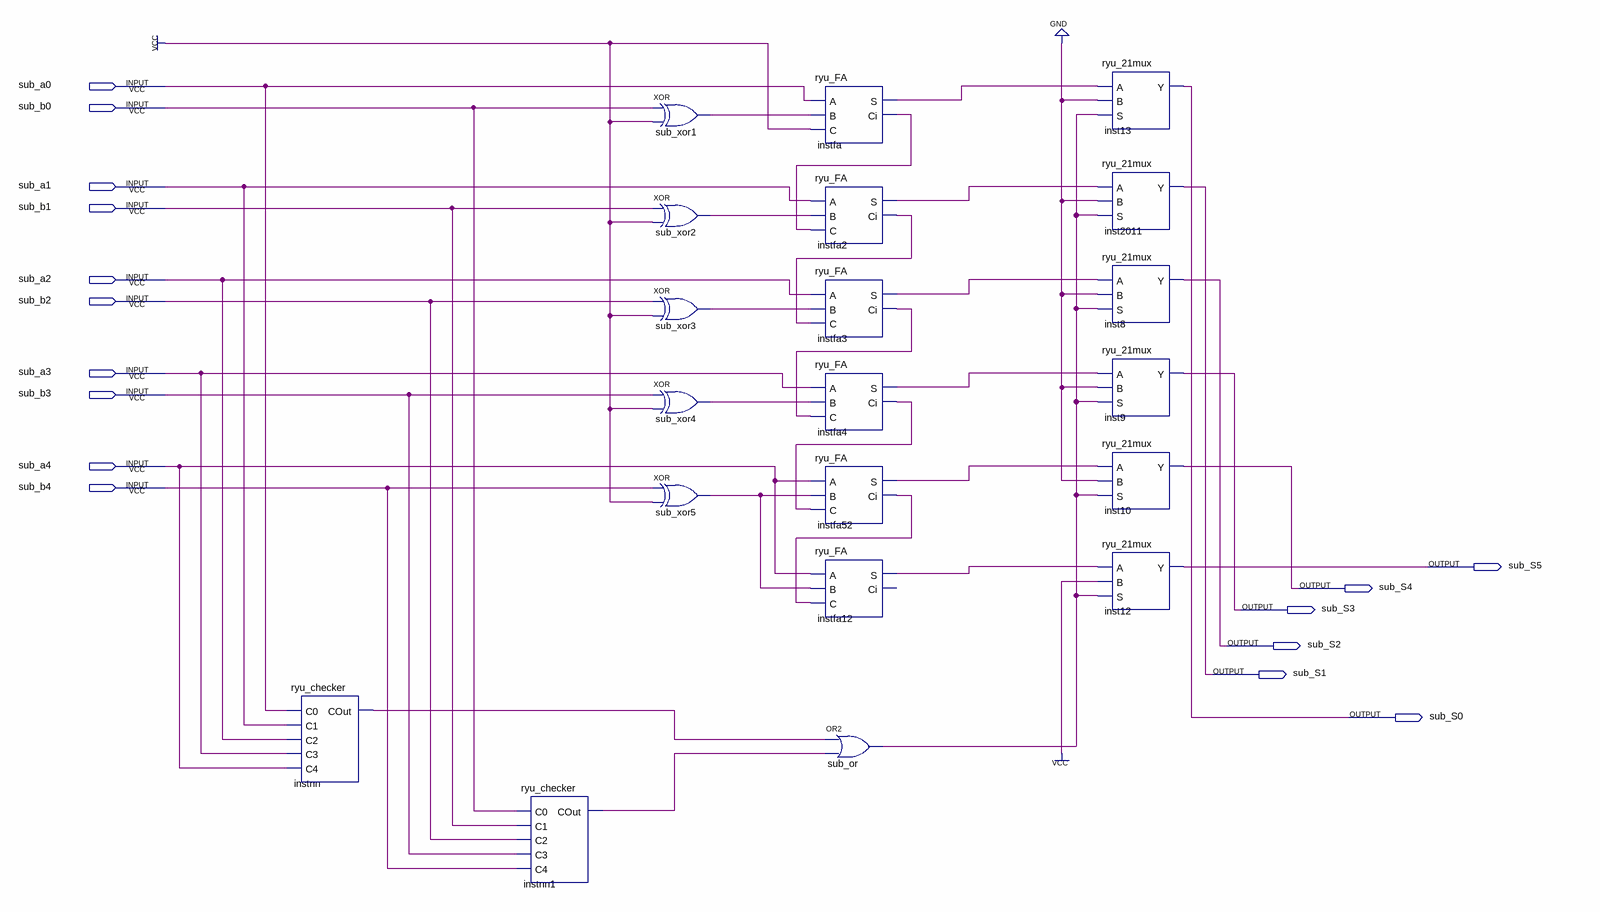
[diagram p0: schematic sheet]
// Quartus schematic ryu_subtractor.bdf as structural Verilog: 20 symbols, 16 pins
module ryu_subtractor (
  input  sub_a0,
  input  sub_b0,
  input  sub_a1,
  input  sub_b1,
  input  sub_a2,
  input  sub_b2,
  input  sub_a3,
  input  sub_b3,
  input  sub_a4,
  input  sub_b4,
  output sub_S5,
  output sub_S4,
  output sub_S3,
  output sub_S2,
  output sub_S1,
  output sub_S0
);

  wire instfa2_ci, instfa2_s, instfa3_ci, instfa3_s, instfa4_ci, instfa4_s, instfa12_s, instfa52_ci,
       instfa52_s, instfa_ci, instfa_s, instnn1_cout, instnn_cout, sub_or_out, sub_xor1_out, sub_xor2_out,
       sub_xor3_out, sub_xor4_out, sub_xor5_out;

  ryu_checker instnn (.C0(sub_a0), .C1(sub_a1), .C2(sub_a2), .C3(sub_a3), .C4(sub_a4), .COut(instnn_cout));
  ryu_checker instnn1 (.C0(sub_b0), .C1(sub_b1), .C2(sub_b2), .C3(sub_b3), .C4(sub_b4), .COut(instnn1_cout));
  xor sub_xor1 (sub_xor1_out, sub_b0, 1'b1);
  xor sub_xor2 (sub_xor2_out, sub_b1, 1'b1);
  xor sub_xor3 (sub_xor3_out, sub_b2, 1'b1);
  xor sub_xor4 (sub_xor4_out, sub_b3, 1'b1);
  xor sub_xor5 (sub_xor5_out, sub_b4, 1'b1);
  ryu_FA instfa (.A(sub_a0), .B(sub_xor1_out), .C(1'b1), .S(instfa_s), .Ci(instfa_ci));
  ryu_FA instfa2 (.A(sub_a1), .B(sub_xor2_out), .C(instfa_ci), .S(instfa2_s), .Ci(instfa2_ci));
  ryu_FA instfa3 (.A(sub_a2), .B(sub_xor3_out), .C(instfa2_ci), .S(instfa3_s), .Ci(instfa3_ci));
  ryu_FA instfa4 (.A(sub_a3), .B(sub_xor4_out), .C(instfa3_ci), .S(instfa4_s), .Ci(instfa4_ci));
  ryu_FA instfa52 (.A(sub_a4), .B(sub_xor5_out), .C(instfa4_ci), .S(instfa52_s), .Ci(instfa52_ci));
  ryu_FA instfa12 (.A(sub_a4), .B(sub_xor5_out), .C(instfa52_ci), .S(instfa12_s));  // open: Ci
  or sub_or (sub_or_out, instnn_cout, instnn1_cout);
  ryu_21mux inst13 (.A(instfa_s), .B(1'b0), .S(sub_or_out), .Y(sub_S0));
  ryu_21mux inst2011 (.A(instfa2_s), .B(1'b0), .S(sub_or_out), .Y(sub_S1));
  ryu_21mux inst8 (.A(instfa3_s), .B(1'b0), .S(sub_or_out), .Y(sub_S2));
  ryu_21mux inst9 (.A(instfa4_s), .B(1'b0), .S(sub_or_out), .Y(sub_S3));
  ryu_21mux inst10 (.A(instfa52_s), .B(1'b0), .S(sub_or_out), .Y(sub_S4));
  ryu_21mux inst12 (.A(instfa12_s), .B(1'b1), .S(sub_or_out), .Y(sub_S5));
endmodule
